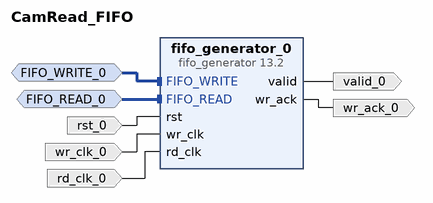
[diagram p0: block diagram of the top level]
# Vivado block design CamRead_FIFO, xc7z020clg400-3, Vivado 2020.2
create_bd_design CamRead_FIFO

create_bd_intf_port -mode Slave -vlnv xilinx.com:interface:fifo_write_rtl:1.0 FIFO_WRITE_0
create_bd_intf_port -mode Slave -vlnv xilinx.com:interface:fifo_read_rtl:1.0 FIFO_READ_0
create_bd_port -dir I rst_0
create_bd_port -dir I -type clk wr_clk_0
create_bd_port -dir I -type clk rd_clk_0
create_bd_port -dir O wr_ack_0
create_bd_port -dir O valid_0

create_bd_cell -type ip -vlnv xilinx.com:ip:fifo_generator:13.2 fifo_generator_0
set_property -dict [list \
  CONFIG.Fifo_Implementation Independent_Clocks_Builtin_FIFO \
  CONFIG.Input_Data_Width 8 \
  CONFIG.Input_Depth 512 \
  CONFIG.Read_Clock_Frequency 100 \
  CONFIG.Valid_Flag true \
  CONFIG.Write_Acknowledge_Flag true \
  CONFIG.Write_Clock_Frequency 25 \
] [get_bd_cells fifo_generator_0]

# ---- connections ----

connect_bd_intf_net -intf_net FIFO_WRITE_0_1 [get_bd_intf_ports FIFO_WRITE_0] [get_bd_intf_pins fifo_generator_0/FIFO_WRITE]
connect_bd_intf_net -intf_net FIFO_READ_0_1 [get_bd_intf_ports FIFO_READ_0] [get_bd_intf_pins fifo_generator_0/FIFO_READ]
connect_bd_net -net rst_0_1 [get_bd_ports rst_0] [get_bd_pins fifo_generator_0/rst]
connect_bd_net -net wr_clk_0_1 [get_bd_ports wr_clk_0] [get_bd_pins fifo_generator_0/wr_clk]
connect_bd_net -net rd_clk_0_1 [get_bd_ports rd_clk_0] [get_bd_pins fifo_generator_0/rd_clk]
connect_bd_net [get_bd_pins fifo_generator_0/wr_ack] [get_bd_ports wr_ack_0]
connect_bd_net [get_bd_pins fifo_generator_0/valid] [get_bd_ports valid_0]

validate_bd_design
save_bd_design
